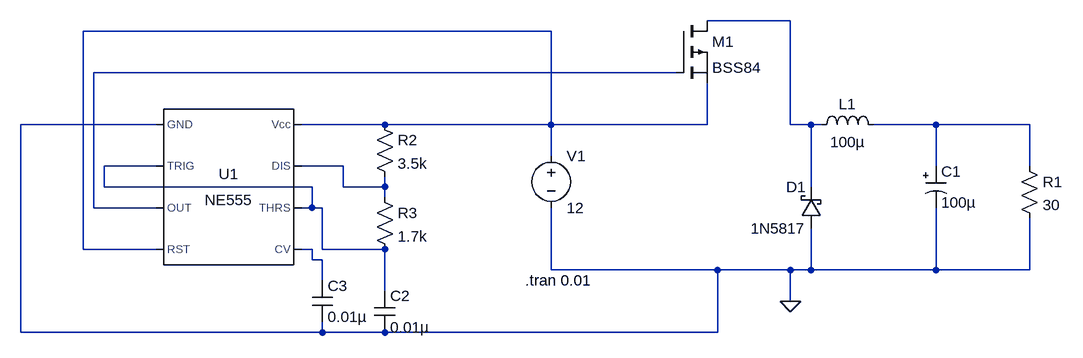
[diagram p0: schematic schematic.asc.asc]
schematic.asc.asc, the LTspice schematic file:
Version 4.1
SHEET 1 1280 680
WIRE 576 -80 448 -80
WIRE 208 -64 -512 -64
WIRE 400 0 -496 0
WIRE -400 80 -608 80
WIRE -48 80 -176 80
WIRE 208 80 208 -64
WIRE 208 80 -48 80
WIRE 448 80 448 16
WIRE 448 80 208 80
WIRE 576 80 576 -80
WIRE 608 80 576 80
WIRE 624 80 608 80
WIRE 800 80 704 80
WIRE 944 80 800 80
WIRE 208 128 208 80
WIRE -400 144 -480 144
WIRE -112 144 -176 144
WIRE 800 144 800 80
WIRE 944 144 944 80
WIRE -480 176 -480 144
WIRE -160 176 -480 176
WIRE -112 176 -112 144
WIRE -48 176 -48 160
WIRE -48 176 -112 176
WIRE 608 176 608 80
WIRE -48 192 -48 176
WIRE -496 208 -496 0
WIRE -400 208 -496 208
WIRE -160 208 -160 176
WIRE -160 208 -176 208
WIRE -144 208 -160 208
WIRE -512 272 -512 -64
WIRE -400 272 -512 272
WIRE -160 272 -176 272
WIRE -144 272 -144 208
WIRE -48 272 -144 272
WIRE -160 288 -160 272
WIRE -144 288 -160 288
WIRE 208 304 208 208
WIRE 464 304 208 304
WIRE 576 304 464 304
WIRE 608 304 608 240
WIRE 608 304 576 304
WIRE 800 304 800 208
WIRE 800 304 608 304
WIRE 944 304 944 224
WIRE 944 304 800 304
WIRE -144 320 -144 288
WIRE -48 336 -48 272
WIRE 576 352 576 304
WIRE -608 400 -608 80
WIRE -144 400 -144 384
WIRE -144 400 -608 400
WIRE -48 400 -144 400
WIRE 464 400 464 304
WIRE 464 400 -48 400
FLAG 576 352 0
SYMBOL voltage 208 112 R0
WINDOW 123 0 0 Left 0
WINDOW 39 0 0 Left 0
SYMATTR InstName V1
SYMATTR Value 12
SYMBOL ind 608 96 R270
WINDOW 0 32 56 VTop 2
WINDOW 3 5 56 VBottom 2
SYMATTR InstName L1
SYMATTR Value 100µ
SYMATTR SpiceLine Rser=1m
SYMBOL res 928 128 R0
SYMATTR InstName R1
SYMATTR Value 30
SYMBOL pmos 400 -80 R0
SYMATTR InstName M1
SYMATTR Value BSS84
SYMBOL polcap 784 144 R0
SYMATTR InstName C1
SYMATTR Value 100µ
SYMBOL Misc\\NE555 -288 176 R0
SYMATTR InstName U1
SYMBOL res -64 64 R0
SYMATTR InstName R2
SYMATTR Value 3.5k
SYMBOL res -64 176 R0
SYMATTR InstName R3
SYMATTR Value 1.7k
SYMBOL cap -64 336 R0
SYMATTR InstName C2
SYMATTR Value 0.01µ
SYMBOL cap -160 320 R0
SYMATTR InstName C3
SYMATTR Value 0.01µ
SYMBOL schottky 624 240 R180
WINDOW 0 24 64 Left 2
WINDOW 3 24 0 Left 2
SYMATTR InstName D1
SYMATTR Value 1N5817
TEXT 168 320 Left 2 !.tran 0.01

The netlist it stands for:
* schematic.asc.asc
V1 N002 0 12
L1 N001 N004 100µ Rser=1m
R1 N004 0 30
M1 N001 N003 N002 N002 BSS84
C1 N004 0 100µ
X§U1 0 N005 N003 N002 N007 N005 N006 N002 NE555  ; pins GND TRIG OUT RST CV THRS DIS Vcc
R2 N002 N006 3.5k
R3 N006 N005 1.7k
C2 N005 0 0.01µ
C3 N007 0 0.01µ
D1 0 N001 1N5817
.model D D
.lib standard.dio
.model NMOS NMOS
.model PMOS PMOS
.lib standard.mos
.tran 0.01
.lib NE555.sub
.backanno
.end